# EAGLE design drive_pcb (EAGLE 9.6.2)
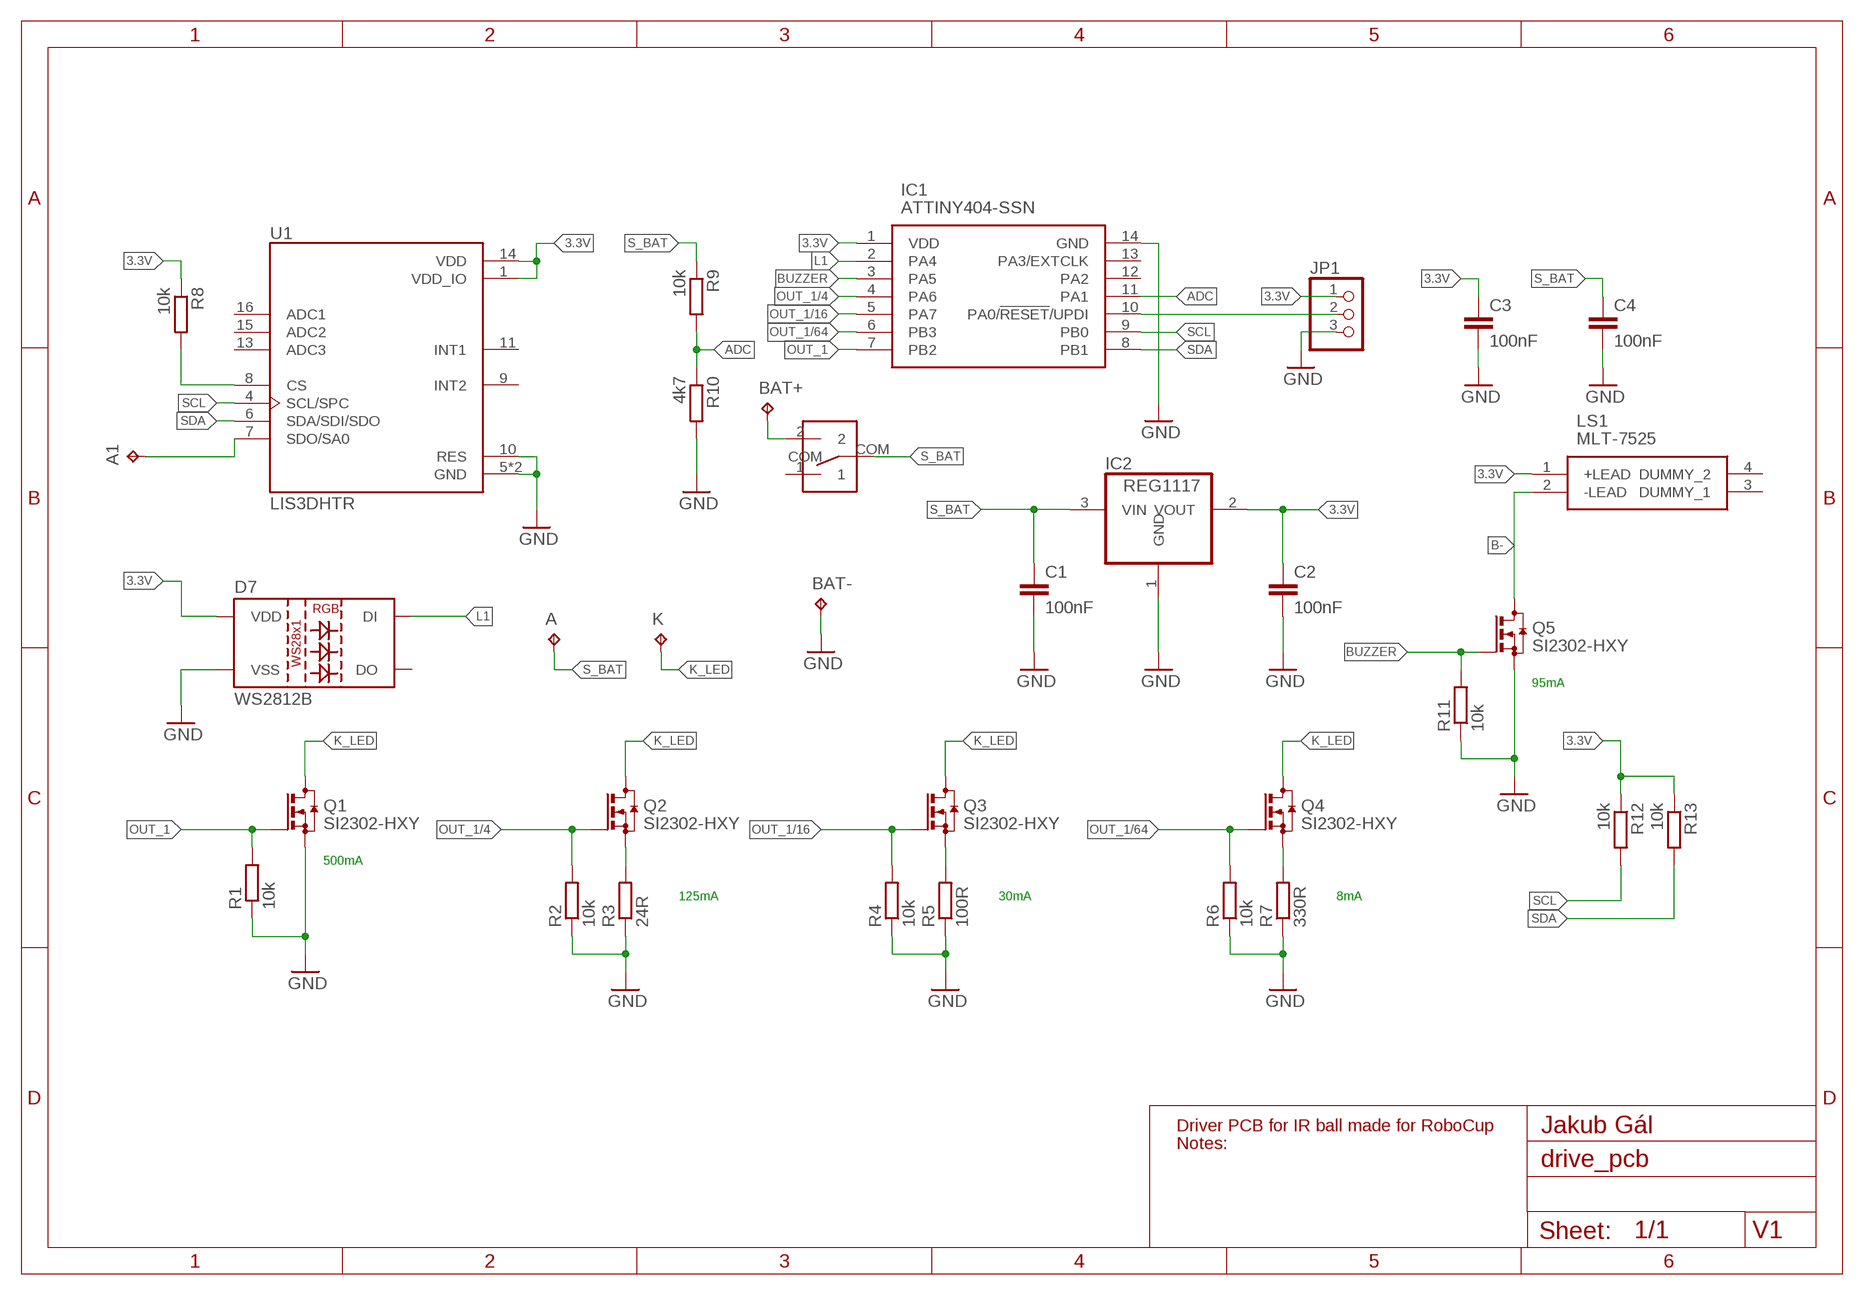
[diagram p0: schematic, sheet 1]

## Parts
A  TPB1,27  [B1,27]
A1  TPB1,27  [B1,27]
BAT+  TPB1,27  [B1,27]
BAT-  TPB1,27  [B1,27]
C1  100nF  C-EUC0603  [C0603]
C2  100nF  C-EUC0603  [C0603]
C3  100nF  C-EUC0603  [C0603]
C4  100nF  C-EUC0603  [C0603]
D7  WS2812B  [WS2812B]
IC1  ATTINY404-SSN  [SOIC127P600X175-14N]
IC2  REG1117  [SOT223]
JP1  PINHD-1X3  [1X03]
K  TPB1,27  [B1,27]
LS1  MLT-7525  [MLT7525]
Q1  SI2302-HXY  BSS123  [SOT23]
Q2  SI2302-HXY  BSS123  [SOT23]
Q3  SI2302-HXY  BSS123  [SOT23]
Q4  SI2302-HXY  BSS123  [SOT23]
Q5  SI2302-HXY  BSS123  [SOT23]
R1  10k  R-EU_R0603  [R0603]
R2  10k  R-EU_R0603  [R0603]
R3  24R  R-EU_R0603  [R0603]
R4  10k  R-EU_R0603  [R0603]
R5  100R  R-EU_R0603  [R0603]
R6  10k  R-EU_R0603  [R0603]
R7  330R  R-EU_R0603  [R0603]
R8  10k  R-EU_R0603  [R0603]
R9  10k  R-EU_R0603  [R0603]
R10  4k7  R-EU_R0603  [R0603]
R11  10k  R-EU_R0603  [R0603]
R12  10k  R-EU_R0603  [R0603]
R13  10k  R-EU_R0603  [R0603]
U1  LIS3DHTR  [XDCR_LIS3DHTR]
U$1  SK12D07VG4  [SK12D07VG4]

## Nets
3.3V: C2.1 C3.1 D7.1(VDD) IC1.1(VDD) IC2.2(VOUT) JP1.1 LS1.1(+LEAD) R8.1 R12.1 R13.1 U1.1(VDD_IO) U1.14(VDD)
ADC: IC1.11(PA1) R9.2 R10.1
B-: LS1.2(-LEAD) Q5.3(D)
BUZZER: IC1.3(PA5) Q5.1(G) R11.2
GND: BAT-.TP C1.2 C2.2 C3.2 C4.2 D7.3(VSS) IC1.14(GND) IC2.1(GND) JP1.3 Q1.2(S) Q5.2(S) R1.1 R2.1 R3.1 R4.1 R5.1 R6.1 R7.1 R10.2 R11.1 U1.5(GND) U1.10(RES) U1.12(GND)
K_LED: K.TP Q1.3(D) Q2.3(D) Q3.3(D) Q4.3(D)
L1: D7.4(DI) IC1.2(PA4)
N$1: Q2.2(S) R3.2
N$2: Q3.2(S) R5.2
N$3: Q4.2(S) R7.2
N$4: R8.2 U1.8(CS)
N$5: IC1.10(PA0/!RESET!/UPDI) JP1.2
N$6: A1.TP U1.7(SDO/SA0)
N$7: BAT+.TP U$1.2
OUT_1: IC1.7(PB2) Q1.1(G) R1.2
OUT_1/4: IC1.4(PA6) Q2.1(G) R2.2
OUT_1/16: IC1.5(PA7) Q3.1(G) R4.2
OUT_1/64: IC1.6(PB3) Q4.1(G) R6.2
S_BAT: A.TP C1.1 C4.1 IC2.3(VIN) R9.1 U$1.COM
SCL: IC1.9(PB0) R12.2 U1.4(SCL/SPC)
SDA: IC1.8(PB1) R13.2 U1.6(SDA/SDI/SDO)
Unconnected: D7.2(DO) IC1.12(PA2) IC1.13(PA3/EXTCLK) LS1.3(DUMMY_1) LS1.4(DUMMY_2) U1.9(INT2) U1.11(INT1) U1.13(ADC3) U1.15(ADC2) U1.16(ADC1) U$1.1

## Notes on the sheet
- 95mA
- 500mA
- 125mA | 30mA | 8mA
- Driver PCB for IR ball made for RoboCup | Jakub Gál
- Notes:
- V1

## Library data of the parts
A A1 BAT+ BAT- K = testpad:TP: Test pad
C1-C4 = rcl:C-EU: CAPACITOR, European symbol; SPICEPREFIX: C
D7 = SparkFun-LED:WS2812B: WS2812B SMD addressable RGB LED 5x5mm SMD LED with built-in controller IC. Color: Red/Green/Blue mC Rating: RGB: 390, 660, 180 mcd Forward Voltage: RGB: 2.0, 3.0, 3.0 V Packages:WS2812B SparkFun Products: Blynk Board - ESP8266 <https://www.sparkfun.com/products/13794>; PROD_ID: DIO-12503
IC1 = ATTINY404-SSN:ATTINY404-SSN: 8-bit Microcontrollers - MCU 20MHz, 4KB, SOIC14, Ind 105C, Green, Tube Source: Datasheet <https://componentsearchengine.com/Datasheets/2/ATTINY404-SSN.pdf>; DESCRIPTION: 8-bit Microcontrollers - MCU 20MHz, 4KB, SOIC14, Ind 105C, Green, Tube; HEIGHT: 1.75mm; MANUFACTURER_NAME: Microchip; MANUFACTURER_PART_NUMBER: ATTINY404-SSN; MOUSER_PART_NUMBER: 579-ATTINY404-SSN; MOUSER_PRICE-STOCK: https://www.mouser.co.uk/ProductDetail/Microchip-Technology-Atmel/ATTINY404-SSN?qs=3HJ2avRr9PJ8OrTjUlXZkg%3D%3D
IC2 = burr-brown:REG1117: 800mA and 1A Low Dropout (LDO) Positive Regulator 1.8V, 2.5V, 2.85V, 3.3V, 5V, and Adj; MPN: REG1117; OC_FARNELL: 1097566; OC_NEWARK: 14P6981
JP1 = pinhead:PINHD-1X3: PIN HEADER
LS1 = MLT-7525:MLT-7525: Buzzers Magnetic NO 2700Hz 3.6V 2.5 ~ 4.5V 7.5mm x 7.5mm 7.5*7.5*2.5mm RoHS Source: Datasheet <https://datasheet.lcsc.com/szlcsc/Jiangsu-Huaneng-Elec-MLT-7525_C95299.pdf>; DESCRIPTION: Buzzers Magnetic NO 2700Hz 3.6V 2.5 ~ 4.5V 7.5mm x 7.5mm 7.5*7.5*2.5mm RoHS; HEIGHT: 2.5mm; MANUFACTURER_NAME: Jiangsu Huaneng Elec; MANUFACTURER_PART_NUMBER: MLT-7525
Q1-Q5 = transistor-small-signal:BSS123: N-CHANNEL MOS FET
R1-R13 = rcl:R-EU_: RESISTOR, European symbol; SPICEPREFIX: R
U1 = LIS3DHTR:LIS3DHTR: MEMS digital output motion sensor ultra low-power high performance 3-axes "nano" accelerometer Check availability <https://pricing.snapeda.com/parts/LIS3DHTR/STMicroelectronics/view-part?ref=eda>; AVAILABILITY: In Stock; DESCRIPTION: Accelerometer X, Y, Z Axis ±2g, 4g, 8g, 16g 0.5Hz ~ 625Hz 16-LGA (3x3); MF: STMicroelectronics; MP: LIS3DHTR; PACKAGE: LGA-16 STMicroelectronics; PRICE: None; PURCHASE-URL: https://pricing.snapeda.com/search/part/LIS3DHTR/?ref=eda
U$1 = SK12D07VG4:SK12D07VG4: SPDT switch LCSC very cheap Check availability <https://pricing.snapeda.com/parts/SK12D07VG4/C%26K/view-part?ref=eda>; AVAILABILITY: In Stock; DESCRIPTION: Switch Slide ON ON SPDT Side Slide 0.3A 30VDC PC Pins Bracket Mount/Through Hole Bulk; MF: C&K; MP: SK12D07VG4; PACKAGE: None; PRICE: None; PURCHASE-URL: https://pricing.snapeda.com/search/part/SK12D07VG4/?ref=eda

## Board
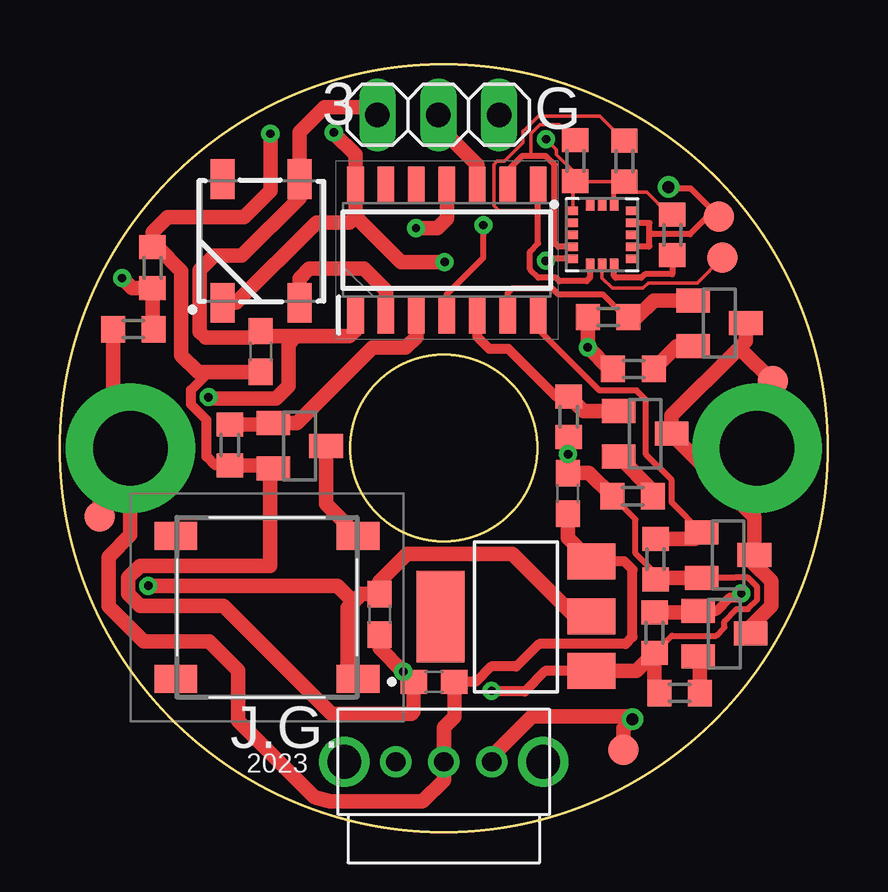
[diagram p1: board, top side]
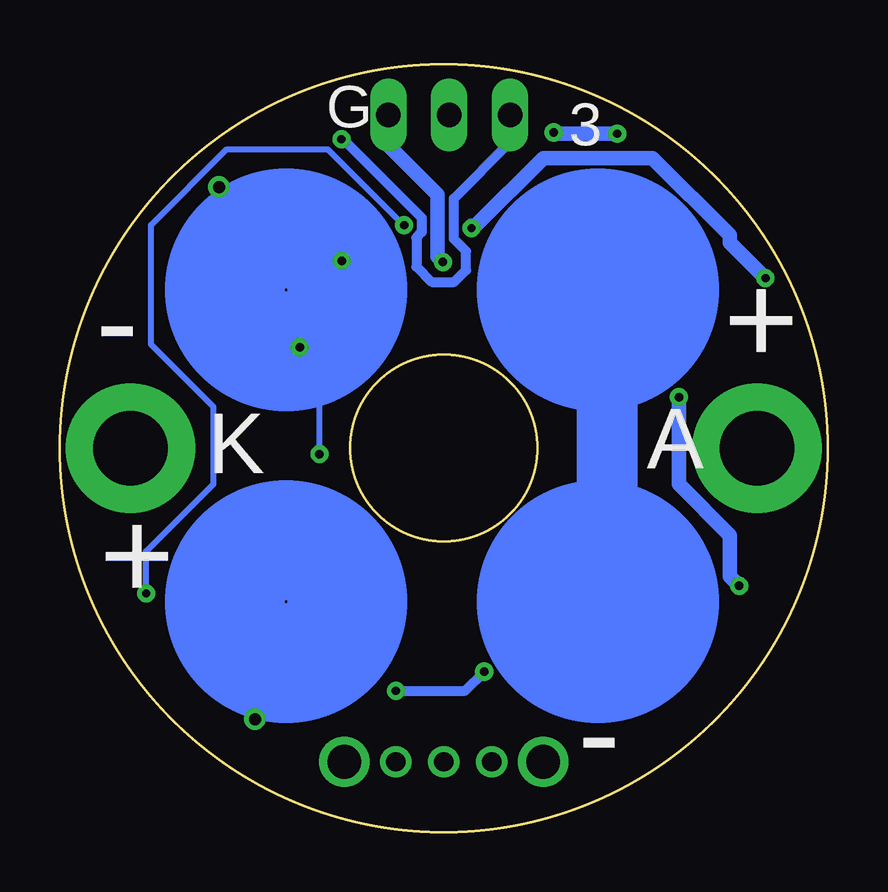
[diagram p2: board, bottom side, seen from below]

Size 32 x 32 mm. Coordinates in mm from the lower left corner, seen from the top.
Outline: circle at 16,16 radius 3.89
Outline: circle at 16,16 radius 16
Copper layers (1*16): Top 0.035mm / dielectric 1.5mm / Bottom 0.035mm
Design rules "default *": minimum track width 6mil, minimum drill 0.35mm, track to track 6mil, track to pad 6mil, pad to pad 6mil, via to via 6mil, smd to smd 6mil, copper to edge 5mil, drill to drill 6mil, minimum pad ring 10mil, minimum via ring 8mil, stop-mask expansion 4mil, vias tented up to drill 0mil, thermal gap 10mil

### Footprints (pad centres in the part's own frame; a part is rotated, then mirrored left to right if it is on the bottom)
B1,27 = smd 1.27 x 1.27: TP 0,0
C0603 = smd 1.1 x 1: 1 -0.85,0; 2 0.85,0
WS2812B = smd 1.651 x 1: 1 2.577,-1.6; 2 2.577,1.6; 3 -2.577,1.6; 4 -2.577,-1.6
SOIC127P600X175-14N = smd 1.525 x 0.7: 1 -2.712,3.81; 2 -2.712,2.54; 3 -2.712,1.27; 4 -2.712,0; 5 -2.712,-1.27; 6 -2.712,-2.54; 7 -2.712,-3.81; 8 2.712,-3.81; 9 2.712,-2.54; 10 2.712,-1.27; 11 2.712,0; 12 2.712,1.27; 13 2.712,2.54; 14 2.712,3.81
SOT223 = smd 1.499 x 2.007: 1 -2.261,-3.15; 2 0.025,-3.15; 3 2.311,-3.15 | smd 3.81 x 2.007: 4 0,3.15
1X03 = drill 1.016 long: 1 -2.54,0; 2 0,0; 3 2.54,0
MLT7525 = smd 1.78 x 1.15: 1 -3.795,2.98; 2 -3.795,-2.98; 3 3.795,-2.98; 4 3.795,2.98
SOT23 = smd 1 x 1.4: 1 -0.95,-1.1; 2 0.95,-1.1; 3 0,1.1
R0603 = smd 1 x 1.1: 1 -0.85,0; 2 0.85,0
XDCR_LIS3DHTR = smd 0.45 x 0.35: 1 -1.225,1; 2 -1.225,0.5; 3 -1.225,0; 4 -1.225,-0.5; 5 -1.225,-1; 9 1.225,-1; 10 1.225,-0.5; 11 1.225,0; 12 1.225,0.5; 13 1.225,1 | smd 0.35 x 0.45: 6 -0.5,-1.225; 7 0,-1.225; 8 0.5,-1.225; 14 0.5,1.225; 15 0,1.225; 16 -0.5,1.225
SK12D07VG4 = drill 0.8: 1 -2,0; 2 2,0; COM 0,0 | drill 1.4: M1 -4.15,0; M2 4.15,0

### Placement (x,y rotation side)
A  1.66,13.14 0 top
A1  27.62,23.94 0 top
BAT+  23.49,3.43 0 top
BAT-  27.47,25.65 0 top
C1  21.18,14.11 90 top
C2  13.32,9.07 270 top
C3  8.37,20.03 270 top
C4  15.59,6.26 180 top
D7  8.38,24.64 90 top
IC1  16.13,24.26 90 top
IC2  19.01,8.96 90 top
JP1  15.77,29.89 0 top
K  29.72,18.79 0 top
LS1  8.63,9.36 180 top
Q1  27.85,11.54 270 top
Q2  27.7,8.27 270 top
Q3  24.39,16.6 270 top
Q4  27.49,21.21 270 top
Q5  9.99,16.09 270 top
R1  24.83,11.36 90 top
R2  24.79,8.3 90 top
R3  25.83,5.79 0 top
R4  21.21,17.31 90 top
R5  23.87,13.99 0 top
R6  22.86,21.46 0 top
R7  23.91,19.3 0 top
R8  25.52,24.89 270 top
R9  3.06,20.95 0 top
R10  3.86,23.52 90 top
R11  7.08,16.13 90 top
R12  21.49,27.98 90 top
R13  23.53,27.96 90 top
U1  22.6,24.89 0 top
U$1  16,2.92 0 top

### Tracks (layer width: path | path; a pad name or v marks a point on that pad's centre or on a via)
3.3V  (via drill 0.35)
  Top 0.152: U1.1 21.38,27.11 21.49,27.11 | R8.1 25.38,25.74 24.46,26.66 23.1,26.66 | v20.27,28.88 20.71,28.44 20.71,28.23 21.49,27.45 21.49,27.11 | R12.1 21.5,27.11 R13.1 | R13.1 21.49,27.11
  Top 0.203: 23.1,26.66 U1.14 23.1,26.69 R13.1
  Top 0.406: LS1.1 12,6.81 | 9.85,20.66 9.92,20.6
  Top 0.61: IC2.2 21.46,8.99 18.86,11.59 14.46,11.59 13.32,10.45 C2.1 12.57,9.92 12.25,9.59 | LS1.1 12,6.81 12,9.34 12.25,9.59 | IC1.1 12.32,20.91 12.07,20.66 9.85,20.66 | 9.85,20.66 8.63,20.66 8.44,20.85 8.39,20.85 C3.1 8.33,20.84 8.27,20.84 8.03,20.6 6.06,20.6 5.82,20.84 5.82,23.41 6.43,24.02 7.58,24.02 9.98,26.42 D7.1 9.98,29.17 11.03,30.22 12.9,30.22 JP1.1 | 9.85,20.66 9.54,20.34 9.54,18.59 9.02,18.07 6.25,18.07 v6.2,18.12 | 12.25,9.59 11.58,10.26 v3.68,10.26
  Bottom 0.406: JP1.1 13.23,28.75 15.58,26.4 15.58,24.71 15.07,24.21 15.07,23.42 15.57,22.92 16.5,22.92 17.14,23.56 17.14,24.77 16.92,24.99 16.92,25.6 20.2,28.88 v20.27,28.88
  Bottom 0.61: v3.68,10.26 4.07,10.64 4.07,12.37 6.2,14.5 v6.2,18.12
ADC  (via drill 0.35)
  Top 0.61: R9.2 3.86,21.37 R10.1 3.01,22.67 v2.59,23.09 | IC1.11 16.14,26.95 16.14,25.56 15.75,25.17 v14.84,25.17
  Bottom 0.61: v2.59,23.09 4.07,24.56 4.07,24.87 7.29,28.1 11.85,28.1 14.68,25.27 14.84,25.27 v14.84,25.17
B-
  Top 0.61: LS1.2 11.09,13.67 Q5.3
BAT_CON
  Bottom 2.54: 9.19,22.46 9.19,8.96
BUZZER
  Top 0.61: R11.2 8.83,16.98 Q5.1 9.88,17.04 13.03,20.19 14.41,20.19 14.86,20.64 IC1.3
GND  (via drill 0.35, 0.5)
  Top 0.254: U1.12 24.58,25.39 24.58,24.93 | U1.10 24.54,24.39 24.58,24.43 24.58,24.93 | v25.37,26.88 25.44,26.82 26.3,26.82 BAT-.TP 27,25.65 26.26,24.91 24.59,24.91 24.58,24.93 | U1.5 20.33,23.89 v20.25,23.81 | R2.1 25.51,8.18 27.36,8.18 27.7,8.52 27.7,8.78 28.21,9.29 28.68,9.29 29.07,9.67 29.07,10.21 28.68,10.6 28.14,10.6 28.13,10.59 Q1.2 | R1.1 24.83,10.77 24,11.6 24,13.02 R5.1 | R4.1 21.21,15.77 v21.18,15.75
  Top 0.406: R11.1 6.47,15.28 6.11,15.64 6.11,17.17 5.46,17.82 5.46,18.43 6.11,19.07 6.11,19.15 6.13,19.18 | v25.37,26.88 25.13,26.88 | IC2.1 20.23,6.7 19.38,5.85 18.02,5.85 v17.99,5.88
  Top 0.61: 12.32,25.65 12.06,25.4 10.69,25.4 7.35,22.06 D7.3 | 12.32,25.65 IC1.14 12.32,28.23 11.41,29.13 v11.41,29.16 | R7.1 22.91,19.3 v22.01,20.2 R6.1 | R11.1 8.75,15.28 | 8.75,15.28 Q5.2 | C3.2 6.13,19.18 5.75,19.18 5.06,19.87 5.06,23.37 4.06,24.37 R10.2 3.86,25 4.48,25.63 7.67,25.63 8.77,26.73 v8.77,29.11 | IC2.1 24.04,6.7 R2.1 24.79,5.98 R3.1 | R1.1 24.9,10.59 Q1.2 | R5.1 22.06,14.96 C1.2 v21.18,15.75 | C2.2 13.32,7.67 v14.31,6.68 14.32,6.68 C4.2 14.74,5.02 14.65,4.93 11.33,4.93 6.83,9.42 3.34,9.42 2.85,9.91 2.85,10.61 3.34,11.09 8.75,11.09 8.75,15.28 | 12.32,25.65 14.21,23.76 v16.04,23.76
  Bottom 0.254: v25.37,26.88 23.33,26.88 v20.25,23.81 20.25,21.96 v22.01,20.2 21.18,19.38 v21.18,15.75
  Bottom 0.406: v17.99,5.88 15.11,5.88 v14.31,6.68
  Bottom 0.61: JP1.3 18.31,28.61 16.26,26.56 16.26,23.98 v16.04,23.76 | v8.77,29.11 11.36,29.11 v11.41,29.16
K_LED  (via drill 3.1 pad 5.4)
  Top 0.61: Q4.3 28.59,20.45 28.26,20.12 | 28.26,20.12 25.49,17.35 Q3.3 25.49,16.58 28.95,13.12 Q1.3 28.87,11.47 28.87,11.23 29.65,10.46 29.65,9.43 28.8,8.57 Q2.3 | 28.26,20.12 28.39,20.12 K.TP 29.72,16.65 v29.06,16
L1
  Top 0.61: IC1.2 13.59,22.57 12.67,23.48 10.38,23.48 9.98,23.07 D7.4
N$1
  Top 0.61: R3.2 26.68,7.23 Q2.2
N$2
  Top 0.61: R5.2 24.72,14.22 Q3.2
N$3
  Top 0.61: Q4.2 25.72,20.26 R7.2
N$4
  Top 0.254: R8.2 25.52,23.25 24.39,23.25 24.23,23.1 23.17,23.1 23.1,23.17 U1.8
N$5
  Top 0.61: JP1.2 15.77,29.41 17.4,27.79 IC1.10
N$6
  Top 0.152: U1.7 22.6,23.09 23.02,22.67 24.31,22.67 24.52,22.89 26.57,22.89 A1.TP
N$7  (via drill 0.5)
  Top 0.61: U$1.2 18,3.14 19.68,4.82 23.75,4.82 v23.87,4.7 23.49,4.32 BAT+.TP
OUT_1
  Top 0.254: Q1.1 25.5,13.74 25.5,14.66 24.43,15.73 24.43,18 24.03,18.4 22.49,18.4 19.94,20.95 IC1.7
  Top 0.61: R1.2 26.47,12.21 Q1.1
OUT_1/4  (via drill 0.35)
  Top 0.254: IC1.4 16.13,22.41 17.65,23.94 v17.65,25.3
  Top 0.406: Q2.1 27.38,9.22 27.93,9.77 28.23,9.77 v28.41,9.94
  Top 0.61: Q2.1 26.54,9.15 R2.2
  Bottom 0.254: v28.41,9.94 28.41,11.7 25.6,14.5 25.6,17.71 28.2,20.32 28.2,25.3 25.04,28.46 20.84,28.46 17.68,25.3 v17.65,25.3
OUT_1/16
  Top 0.406: R4.2 20.67,18.16 18.69,20.14 17.9,20.14 17.4,20.64 IC1.5
  Top 0.61: Q3.1 21.82,17.55 R4.2
OUT_1/64
  Top 0.254: IC1.6 18.67,22.48 18.86,22.67 20.51,22.67 20.76,22.41 22.61,22.41 23.56,21.46 R6.2
  Top 0.61: R6.2 24.06,21.46 24.75,22.16 Q4.1
S_BAT  (via drill 3.1 pad 5.4)
  Top 0.406: IC2.3 23.53,11.28 23.87,10.93 23.87,8.12 23.59,7.83 19.97,7.83 19.03,6.89 17.97,6.89 17.34,6.26 C4.1
  Top 0.61: A.TP 1.66,14.72 v2.94,16 | v2.94,16 2.94,17.02 2.21,18 R9.1 | C4.1 16.44,4.8 16,4.35 U$1.COM 16,2.16 15.11,1.27 11.25,1.27 10.69,1.42 10.6,1.46 7.43,4.63 7.43,6.73 6.22,7.94 3.49,7.94 2.03,9.39 2.03,11.47 2.94,12.37 v2.94,16 | IC2.3 21.18,12.25 C1.1
SCL
  Top 0.152: R12.2 20.83,29.48 20.02,29.48 19.64,29.11 19.64,28.18
  Top 0.254: U1.4 20.78,24.39 20.62,24.55 20.62,27.81 20.26,28.18 19.64,28.18 19.26,28.18 18.67,27.58 IC1.9
SDA
  Top 0.152: R13.2 22.5,29.84 19.94,29.84 19.43,29.33 19.3,29.2 19.3,28.72 18.54,27.96 18.22,27.96 18.09,27.82 18.09,26.11 18.3,25.89 19.94,25.89
  Top 0.254: U1.6 22.1,23.11 21.96,22.96 20.82,22.96 20.67,23.11 19.94,23.11 19.6,23.45 19.6,24.2 19.94,24.54 19.94,25.89 IC1.8
(copper drawn outside any net)
  shapes: Bottom circle x4

### Text on the board
tNames: 3 | G | J.G. | 2023
bNames: 3 | G | + | - | A | K | + | -